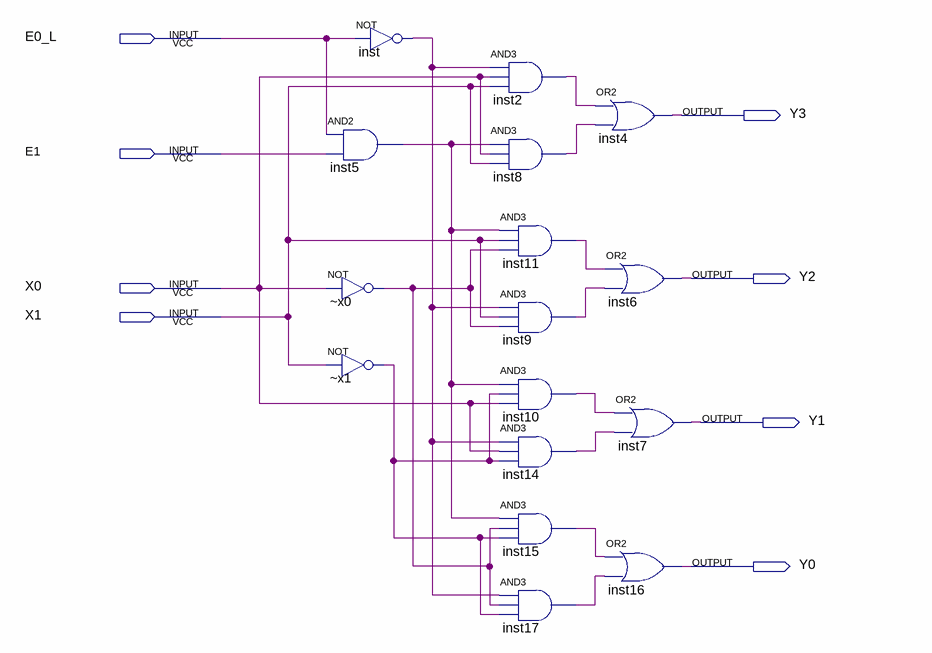
[diagram p0: schematic sheet]
// Quartus schematic Dec2_4.bdf as structural Verilog: 16 symbols, 8 pins
module Dec2_4 (
  input  E0_L,
  input  E1,
  input  X0,
  input  X1,
  output Y3,
  output Y2,
  output Y1,
  output Y0
);

  wire _x0_out, _x1_out, inst2_out, inst5_out, inst8_out, inst9_out, inst10_out, inst11_out, inst14_out,
       inst15_out, inst17_out, inst_out;

  and inst5 (inst5_out, E0_L, E1);
  not \u_~x0  (_x0_out, X0);
  not \u_~x1  (_x1_out, X1);
  not inst (inst_out, E0_L);
  and inst2 (inst2_out, inst_out, X0, X1);
  and inst8 (inst8_out, inst5_out, X0, X1);
  and inst11 (inst11_out, inst5_out, X1, _x0_out);
  and inst9 (inst9_out, inst_out, X1, _x0_out);
  and inst10 (inst10_out, inst5_out, _x1_out, X0);
  and inst14 (inst14_out, inst_out, X0, _x1_out);
  and inst15 (inst15_out, inst5_out, _x0_out, _x1_out);
  and inst17 (inst17_out, inst_out, _x0_out, _x1_out);
  or inst4 (Y3, inst2_out, inst8_out);
  or inst6 (Y2, inst11_out, inst9_out);
  or inst7 (Y1, inst10_out, inst14_out);
  or inst16 (Y0, inst15_out, inst17_out);
endmodule
